# EAGLE design circuit (EAGLE 6.5.0)
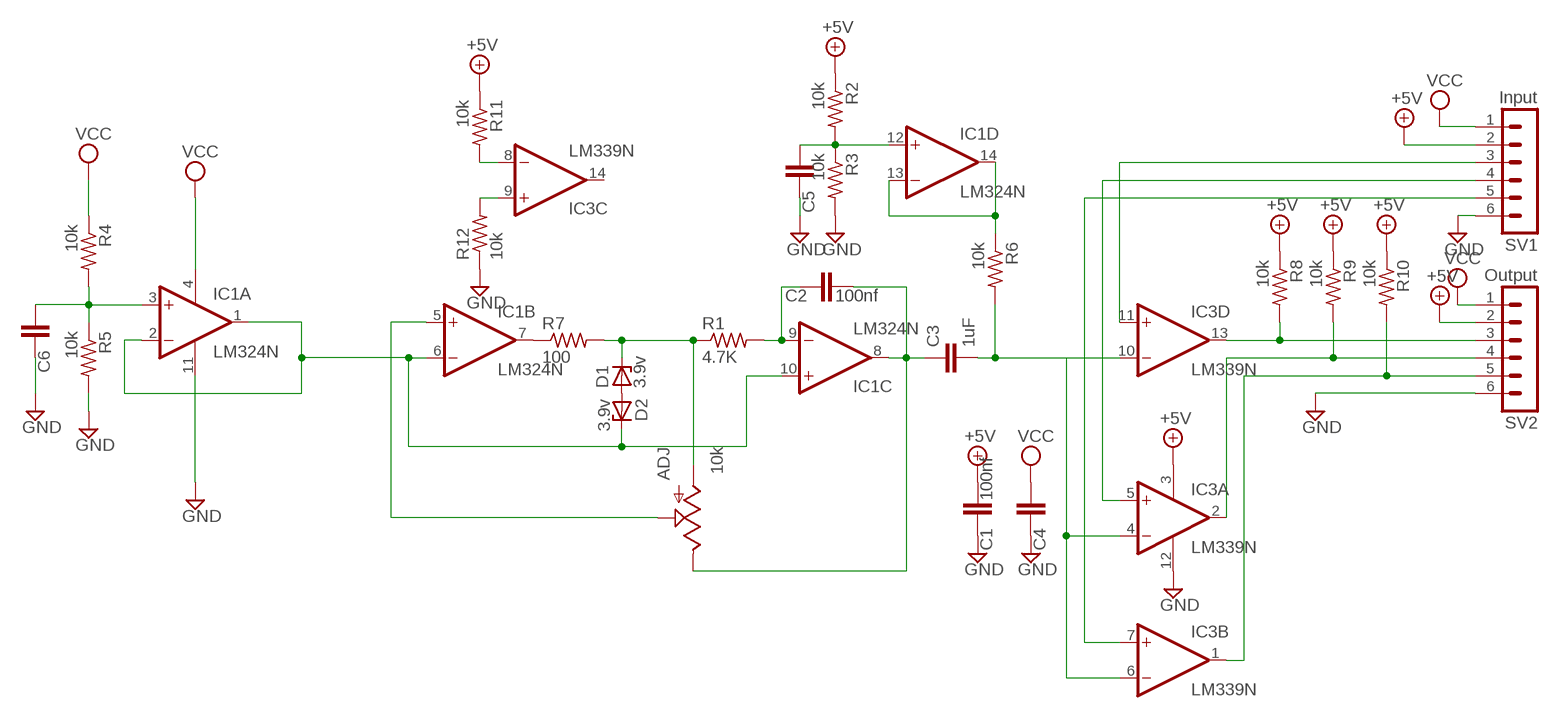
[diagram p0: schematic, sheet 1]

## Parts
ADJ  10k  POTTRIM  [TRIM_POT]
C1  100nf  C-EU050-024X044  [C050-024X044]
C2  100nf  C-EU050-024X044  [C050-024X044]
C3  1uF  C-EU050-035X075  [C050-035X075]
C4  100nf  C-EU050-024X044  [C050-024X044]
C5  100nf  C-EU050-024X044  [C050-024X044]
C6  100nf  C-EU050-024X044  [C050-024X044]
D1  3.9v  ZENER-DIODEDO41Z10  [DO41Z10]
D2  3.9v  ZENER-DIODEDO41Z10  [DO41Z10]
IC1  LM324N  [DIL14]
IC3  LM339N  [DIL14]
R1  4.7K  R-US_0207/12  [0207/12]
R2  10k  R-US_0207/10  [0207/10]
R3  10k  R-US_0207/10  [0207/10]
R4  10k  R-US_0207/10  [0207/10]
R5  10k  R-US_0207/10  [0207/10]
R6  10k  R-US_0207/10  [0207/10]
R7  100  R-US_0207/10  [0207/10]
R8  10k  R-US_0207/7  [0207/7]
R9  10k  R-US_0207/10  [0207/10]
R10  10k  R-US_0207/10  [0207/10]
R11  10k  R-US_0207/10  [0207/10]
R12  10k  R-US_0207/10  [0207/10]
SV1  Input  MA06-1  [MA06-1]
SV2  Output  MA06-1  [MA06-1]

## Nets
+5V: C1.2 IC3.3(P:V+) R2.1 R8.1 R9.1 R10.1 R11.1 SV1.2 SV2.2
ARTGND: D2.C IC1.1(A:OUT) IC1.2(A:-IN) IC1.6(B:-IN) IC1.10(C:+IN)
GND: C1.1 C4.1 C5.1 C6.1 IC1.11(P:V-) IC3.12(P:GND) R3.2 R5.2 R12.1 SV1.6 SV2.6
N$1: ADJ.2(E) C2.2 C3.1 IC1.8(C:OUT)
N$2: IC1.7(B:OUT) R7.1
N$3: D1.A D2.A
N$4: C2.1 IC1.9(C:-IN) R1.2
N$5: IC1.13(D:-IN) IC1.14(D:OUT) R6.1
N$7: ADJ.3(A) D1.C R1.1 R7.2
N$8: C6.2 IC1.3(A:+IN) R4.2 R5.1
N$9: ADJ.1(S) IC1.5(B:+IN)
N$10: IC3.13(D:OUT) R8.2 SV2.3
N$11: IC3.2(A:OUT) R9.2 SV2.4
N$12: IC3.1(B:OUT) R10.2 SV2.5
N$13: IC3.11(D:+IN) SV1.3
N$14: IC3.5(A:+IN) SV1.4
N$15: IC3.7(B:+IN) SV1.5
N$16: C5.2 IC1.12(D:+IN) R2.2 R3.1
N$17: IC3.8(C:-IN) R11.2
N$18: IC3.9(C:+IN) R12.2
N$19: C3.2 IC3.4(A:-IN) IC3.6(B:-IN) IC3.10(D:-IN) R6.2
VCC: C4.2 IC1.4(P:V+) R4.1 SV1.1 SV2.1
Unconnected: IC3.14(C:OUT)

## Library data of the parts
ADJ = SparkFun-Electromechanical:POT
C1 C2 C4-C6 = rcl:C-EU: CAPACITOR, European symbol
C3 = resistor:C-EU: CAPACITOR, European symbol
D1 D2 = diode:ZENER-DIODE: Z-Diode
IC1 = linear:LM324: OP AMP
IC3 = linear:LM339: Low Power Low Offset Voltage Quad Comparators with open collector; LM139/LM239/LM339/LM2901/LM3302
R1-R12 = rcl:R-US_: RESISTOR, American symbol
SV1 SV2 = con-lstb:MA06-1: PIN HEADER; OC_FARNELL: unknown; OC_NEWARK: unknown

## Board
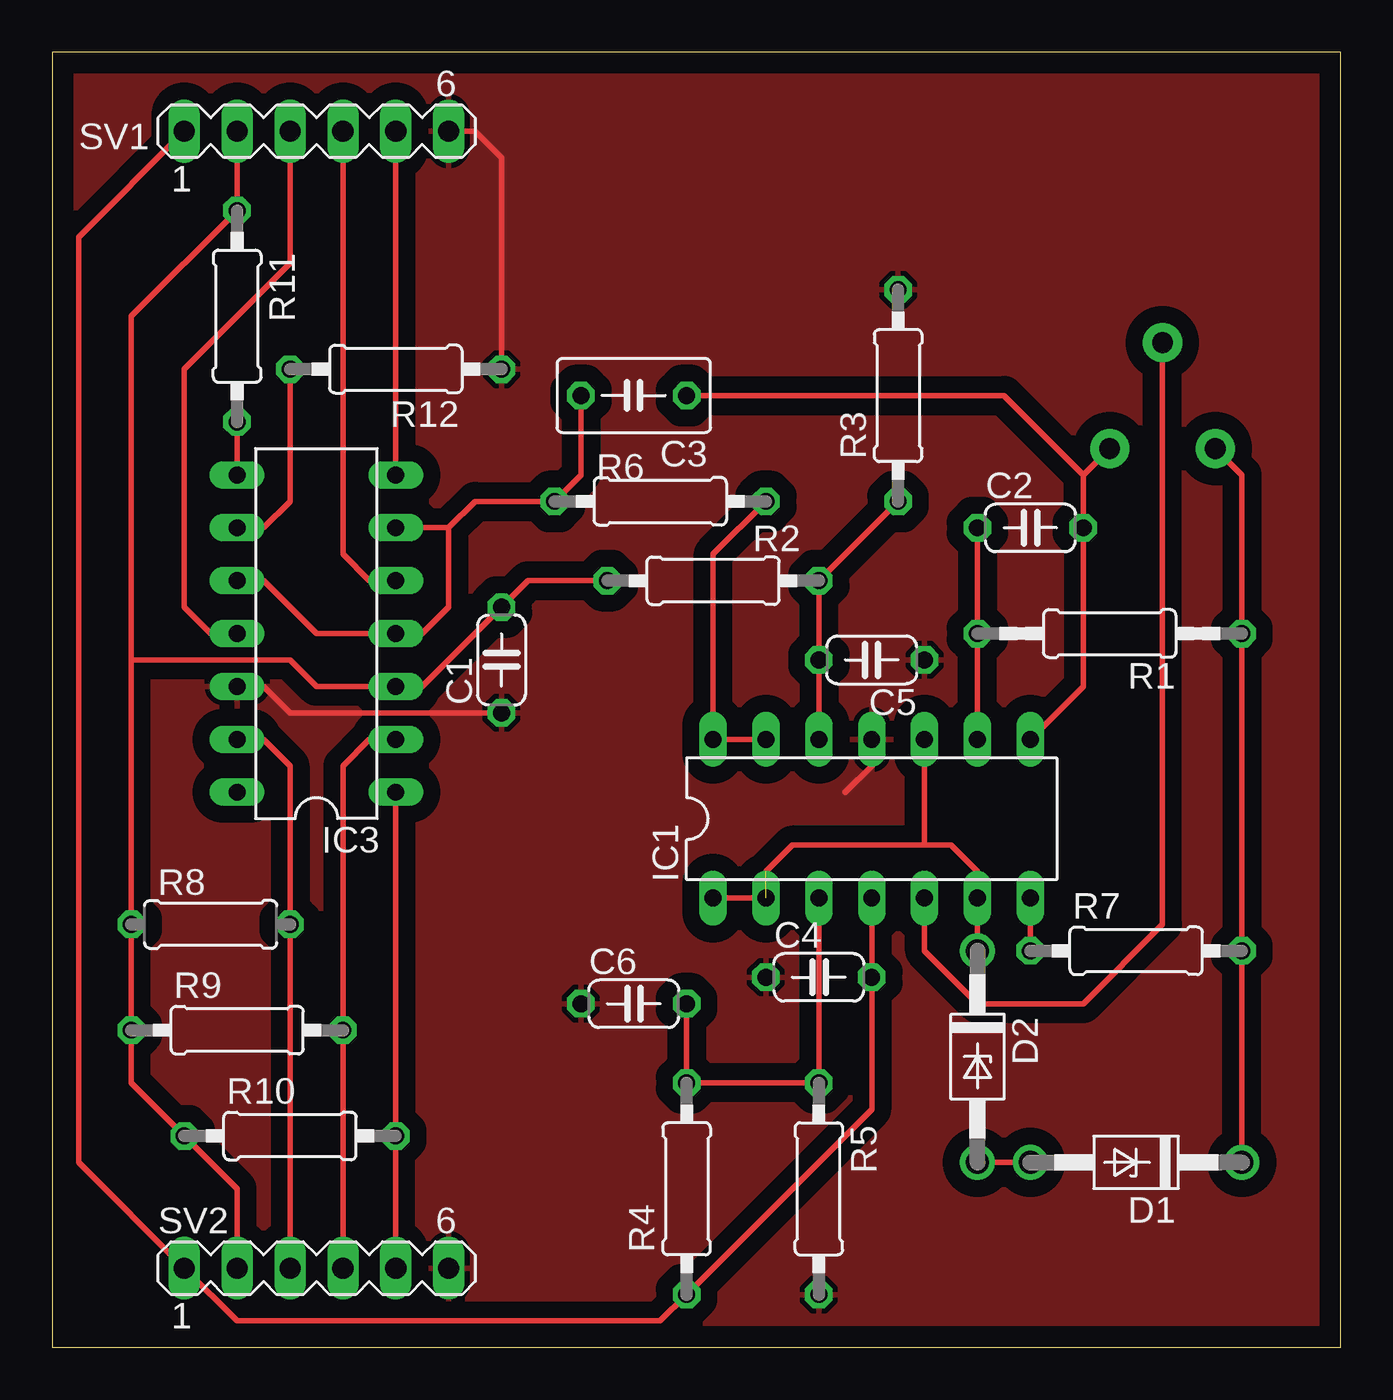
[diagram p1: board, top side]

Size 61.9 x 62.22 mm. Coordinates in mm from the lower left corner, seen from the top.
Outline: 0,0 61.9,0 61.9,62.22 0,62.22 0,0
Copper layers (1*16): Top 0.035mm / dielectric 1.5mm / Bottom 0.035mm
Design rules "default": minimum track width 10mil, minimum drill 24mil, track to track 8mil, track to pad 8mil, pad to pad 8mil, via to via 8mil, smd to smd 8mil, copper to edge 40mil, drill to drill 8mil, minimum pad ring 10mil, minimum via ring 8mil, stop-mask expansion 4mil, vias tented up to drill 0mil, thermal gap 10mil

### Footprints (pad centres in the part's own frame; a part is rotated, then mirrored left to right if it is on the bottom)
TRIM_POT = drill 1 pad 1.88: 1 5.08,0; 2 0,2.54; 3 0,-2.54
C050-024X044 = drill 0.813 octagon: 1 -2.54,0; 2 2.54,0
C050-035X075 = drill 0.813 octagon: 1 -2.54,0; 2 2.54,0
DO41Z10 = drill 1.118: A 5.08,0; C -5.08,0
DIL14 = drill 0.813 long: 1 -7.62,-3.81; 2 -5.08,-3.81; 3 -2.54,-3.81; 4 0,-3.81; 5 2.54,-3.81; 6 5.08,-3.81; 7 7.62,-3.81; 8 7.62,3.81; 9 5.08,3.81; 10 2.54,3.81; 11 0,3.81; 12 -2.54,3.81; 13 -5.08,3.81; 14 -7.62,3.81
0207/12 = drill 0.813 octagon: 1 -6.35,0; 2 6.35,0
0207/10 = drill 0.813 octagon: 1 -5.08,0; 2 5.08,0
0207/7 = drill 0.813 octagon: 1 -3.81,0; 2 3.81,0
MA06-1 = drill 1.016 long: 1 -6.35,0; 2 -3.81,0; 3 -1.27,0; 4 1.27,0; 5 3.81,0; 6 6.35,0

### Placement (x,y rotation side)
ADJ  53.34,43.18 90 top
C1  21.59,33.02 90 top
C2  46.99,39.37 0 top
C3  27.94,45.72 180 top
C4  36.83,17.78 0 top
C5  39.37,33.02 180 top
C6  27.94,16.51 0 top
D1  52.07,8.89 180 top
D2  44.45,13.97 270 top
IC1  39.37,25.4 0 top
IC3  12.7,34.29 90 top
R1  50.8,34.29 180 top
R2  31.75,36.83 0 top
R3  40.64,45.72 90 top
R4  30.48,7.62 90 top
R5  36.83,7.62 270 top
R6  29.21,40.64 180 top
R7  52.07,19.05 0 top
R8  7.62,20.32 0 top
R9  8.89,15.24 0 top
R10  11.43,10.16 0 top
R11  8.89,49.53 270 top
R12  16.51,46.99 180 top
SV1  12.7,58.42 0 top
SV2  12.7,3.81 0 top

### Tracks (layer width: path | path; a pad name or v marks a point on that pad's centre or on a via)
+5V
  Top 0.254: SV1.2 R11.1 3.81,49.53 3.81,33.02 | 3.81,33.02 11.43,33.02 12.7,31.75 IC3.3 17.78,31.75 C1.2 22.86,36.83 R2.1 | SV2.2 8.89,7.62 R10.1 3.81,12.7 R9.1 R8.1 3.81,33.02
ARTGND  (1 unrouted)
  Top 0.254: 41.91,24.13 35.56,24.13 34.29,22.86 | 41.91,24.13 IC1.10 | 41.91,24.13 43.18,24.13 44.45,22.86 IC1.6 D2.C | IC1.1 IC1.2
GND
  Top 0.254: IC3.12 10.16,31.75 11.43,30.48 C1.1 | R12.1 21.59,57.15 20.32,58.42 SV1.6
  Top 0.305: 38.1,26.67 39.37,27.94 IC1.11
  pour Top (isolate 0.813): 0,62.23 62.23,62.23 62.23,0 0,0 0,1.27 0,60.96
N$1
  Top 0.254: IC1.8 49.53,31.75 C2.2 49.53,41.91 | 49.53,41.91 ADJ.2 | C3.1 45.72,45.72 49.53,41.91
N$2
  Top 0.254: IC1.7 R7.1
N$3
  Top 0.254: D2.A D1.A
N$4
  Top 0.254: IC1.9 R1.2 C2.1
N$5
  Top 0.254: IC1.13 IC1.14 31.75,38.1 R6.1
N$7
  Top 0.254: D1.C R7.2 R1.1 57.15,41.91 ADJ.3
N$8
  Top 0.254: IC1.3 R5.1 R4.2 C6.2
N$9
  Top 0.254: IC1.5 41.91,19.05 44.45,16.51 49.53,16.51 53.34,20.32 ADJ.1
N$10
  Top 0.254: IC3.13 10.16,29.21 11.43,27.94 R8.2 SV2.3
N$11
  Top 0.254: SV2.4 R9.2 13.97,27.94 15.24,29.21 IC3.2
N$12
  Top 0.254: SV2.5 R10.2 IC3.1
N$13
  Top 0.254: SV1.3 11.43,52.07 6.35,46.99 6.35,35.56 7.62,34.29 IC3.11
N$14
  Top 0.254: IC3.5 15.24,36.83 13.97,38.1 SV1.4
N$15
  Top 0.254: SV1.5 IC3.7
N$16
  Top 0.254: IC1.12 C5.2 R2.2
  Top 0.305: R2.2 R3.1
N$17
  Top 0.254: IC3.8 R11.2
N$18
  Top 0.254: IC3.9 10.16,39.37 11.43,40.64 R12.2
N$19
  Top 0.254: IC3.10 10.16,36.83 12.7,34.29 IC3.4 17.78,34.29 19.05,35.56 19.05,39.37 | IC3.6 19.05,39.37 | C3.2 25.4,41.91 R6.2 20.32,40.64 19.05,39.37
VCC
  Top 0.254: SV1.1 1.27,53.34 1.27,8.89 SV2.1 8.89,1.27 29.21,1.27 R4.1 39.37,11.43 C4.2 IC1.4

### Text on the board
_tsilk: Andrew Jeddeloh / Analog to PWM / Rev. 5